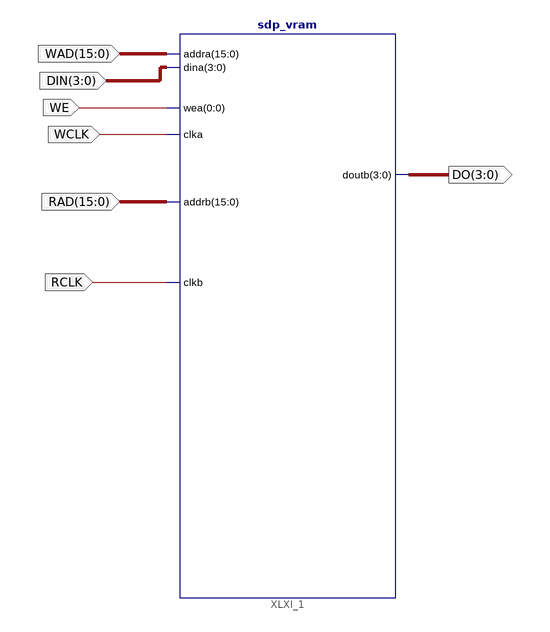
[diagram p0: schematic sheet 1]
// Xilinx ISE schematic sdp_vram_wrapper.sch (spartan6) as structural Verilog: 1 symbols, 7 ports
module sdp_vram_wrapper (
  input  [15:0] WAD,
  input  [3:0] DIN,
  input  WE,
  input  [15:0] RAD,
  input  WCLK,
  input  RCLK,
  output [3:0] DO
);

  sdp_vram XLXI_1 (.addra(WAD), .dina(DIN), .wea(WE), .clka(WCLK), .addrb(RAD), .clkb(RCLK), .doutb(DO));
endmodule
